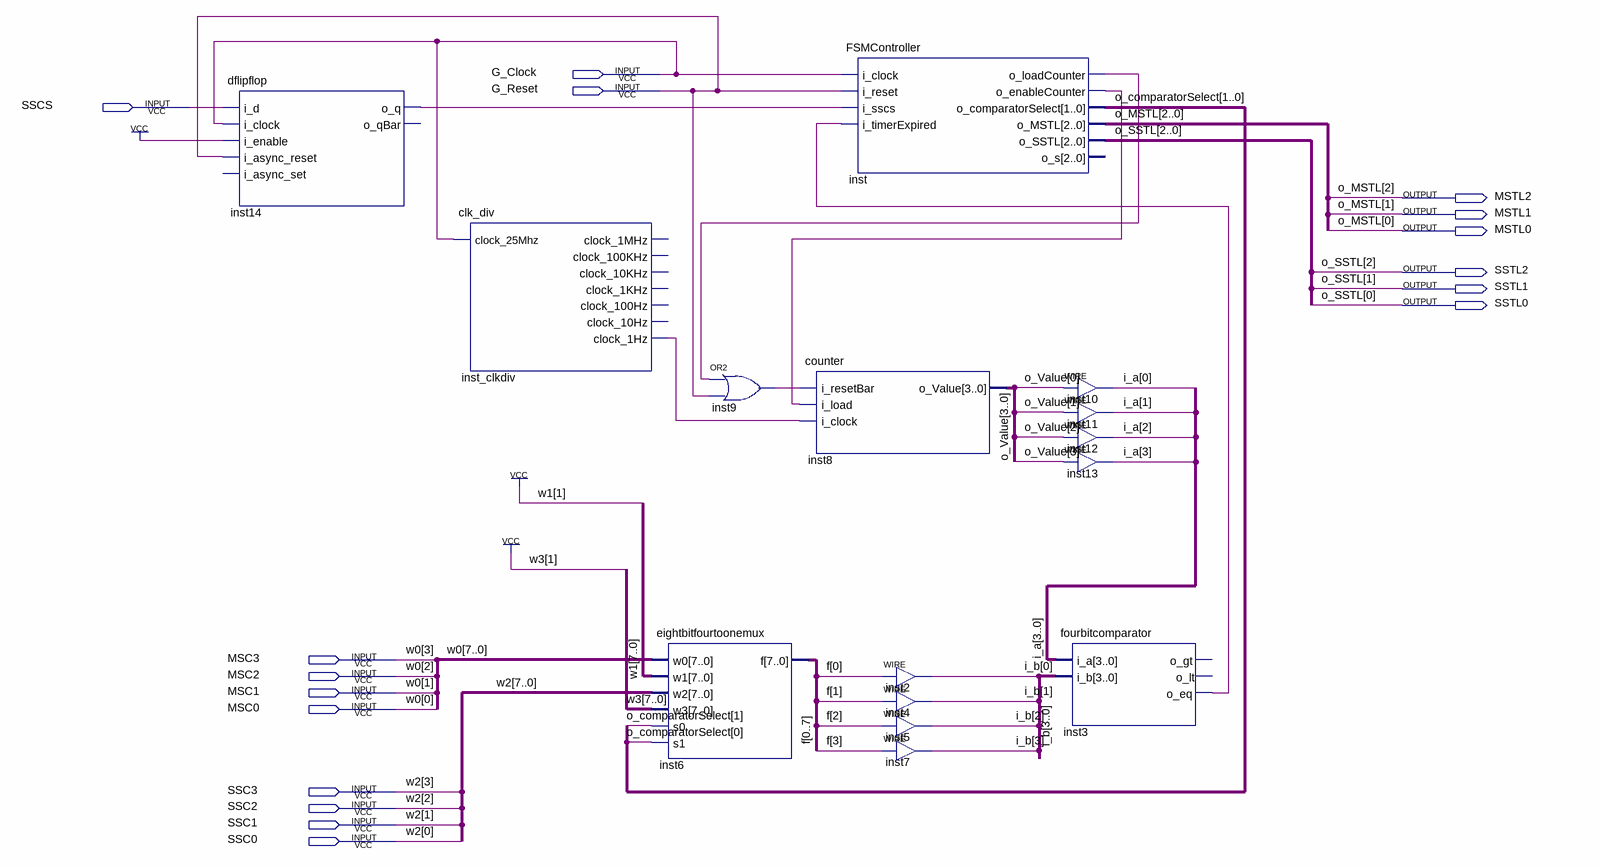
[diagram p0: schematic sheet]
// Quartus schematic TrafficLightController.bdf as structural Verilog: 15 symbols, 17 pins
module TrafficLightController (
  input  G_Clock,
  input  G_Reset,
  input  SSCS,
  input  MSC3,
  input  MSC2,
  input  MSC1,
  input  MSC0,
  input  SSC3,
  input  SSC2,
  input  SSC1,
  input  SSC0,
  output MSTL2,
  output MSTL1,
  output MSTL0,
  output SSTL2,
  output SSTL1,
  output SSTL0
);

  wire inst3_o_eq, inst9_out, inst14_o_q, inst_clkdiv_clock_1hz, inst_o_enablecounter, inst_o_loadcounter;
  wire [1:0] o_comparatorSelect;
  wire [3:0] i_a, i_b, o_Value;
  wire [7:0] f, w1, w3;
  wire [7:4] w0, w2;

  dflipflop inst14 (
    .i_d(SSCS), .i_clock(G_Clock), .i_enable(1'b1), .i_async_reset(G_Reset), .o_q(inst14_o_q));  // open: i_async_set, o_qBar
  clk_div inst_clkdiv (
    .clock_25Mhz(G_Clock), .clock_1Hz(inst_clkdiv_clock_1hz));  // open: clock_1MHz, clock_100KHz, clock_10KHz, clock_1KHz, clock_100Hz, clock_10Hz
  or inst9 (inst9_out, inst_o_loadcounter, G_Reset);
  eightbitfourtoonemux inst6 (
    .w0({w0, MSC3, MSC2, MSC1, MSC0}), .w1({w1[7:2], 1'b1, w1[0]}), .w2({w2, SSC3, SSC2, SSC1, SSC0}),
    .w3({w3[7:2], 1'b1, w3[0]}), .s0(o_comparatorSelect[1]), .s1(o_comparatorSelect[0]),
    .f({f[0], f[1], f[2], f[3], f[4], f[5], f[6], f[7]}));
  FSMController inst (
    .i_clock(G_Clock), .i_reset(G_Reset), .i_sscs(inst14_o_q), .i_timerExpired(inst3_o_eq),
    .o_loadCounter(inst_o_loadcounter), .o_enableCounter(inst_o_enablecounter),
    .o_comparatorSelect(o_comparatorSelect), .o_MSTL({MSTL2, MSTL1, MSTL0}), .o_SSTL({SSTL2, SSTL1, SSTL0}));  // open: o_s
  counter inst8 (
    .i_resetBar(inst9_out), .i_load(inst_o_enablecounter), .i_clock(inst_clkdiv_clock_1hz), .o_Value(o_Value));
  assign i_b[0] = f[0];  // WIRE inst2
  assign i_b[1] = f[1];  // WIRE inst4
  assign i_b[2] = f[2];  // WIRE inst5
  assign i_b[3] = f[3];  // WIRE inst7
  assign i_a[0] = o_Value[0];  // WIRE inst10
  assign i_a[1] = o_Value[1];  // WIRE inst11
  assign i_a[2] = o_Value[2];  // WIRE inst12
  assign i_a[3] = o_Value[3];  // WIRE inst13
  fourbitcomparator inst3 (.i_a(i_a), .i_b(i_b), .o_eq(inst3_o_eq));  // open: o_gt, o_lt

  // Other names for the same wires on the sheet: o_MSTL[2:0] = {MSTL2, MSTL1, MSTL0};
  //   o_SSTL[2:0] = {SSTL2, SSTL1, SSTL0}; w0[3:0] = {MSC3, MSC2, MSC1, MSC0}; w2[3:0] = {SSC3, SSC2, SSC1, SSC0}
endmodule
